# Altium schematic sheet BMS Carrier - Connectors.SchDoc: Connectors
size Tabloid; Author: Liam Sky, Annika Logarta; Revision: 1.0; SheetNumber: 1; SheetTotal: 4; Website: www.uwmidsun.com
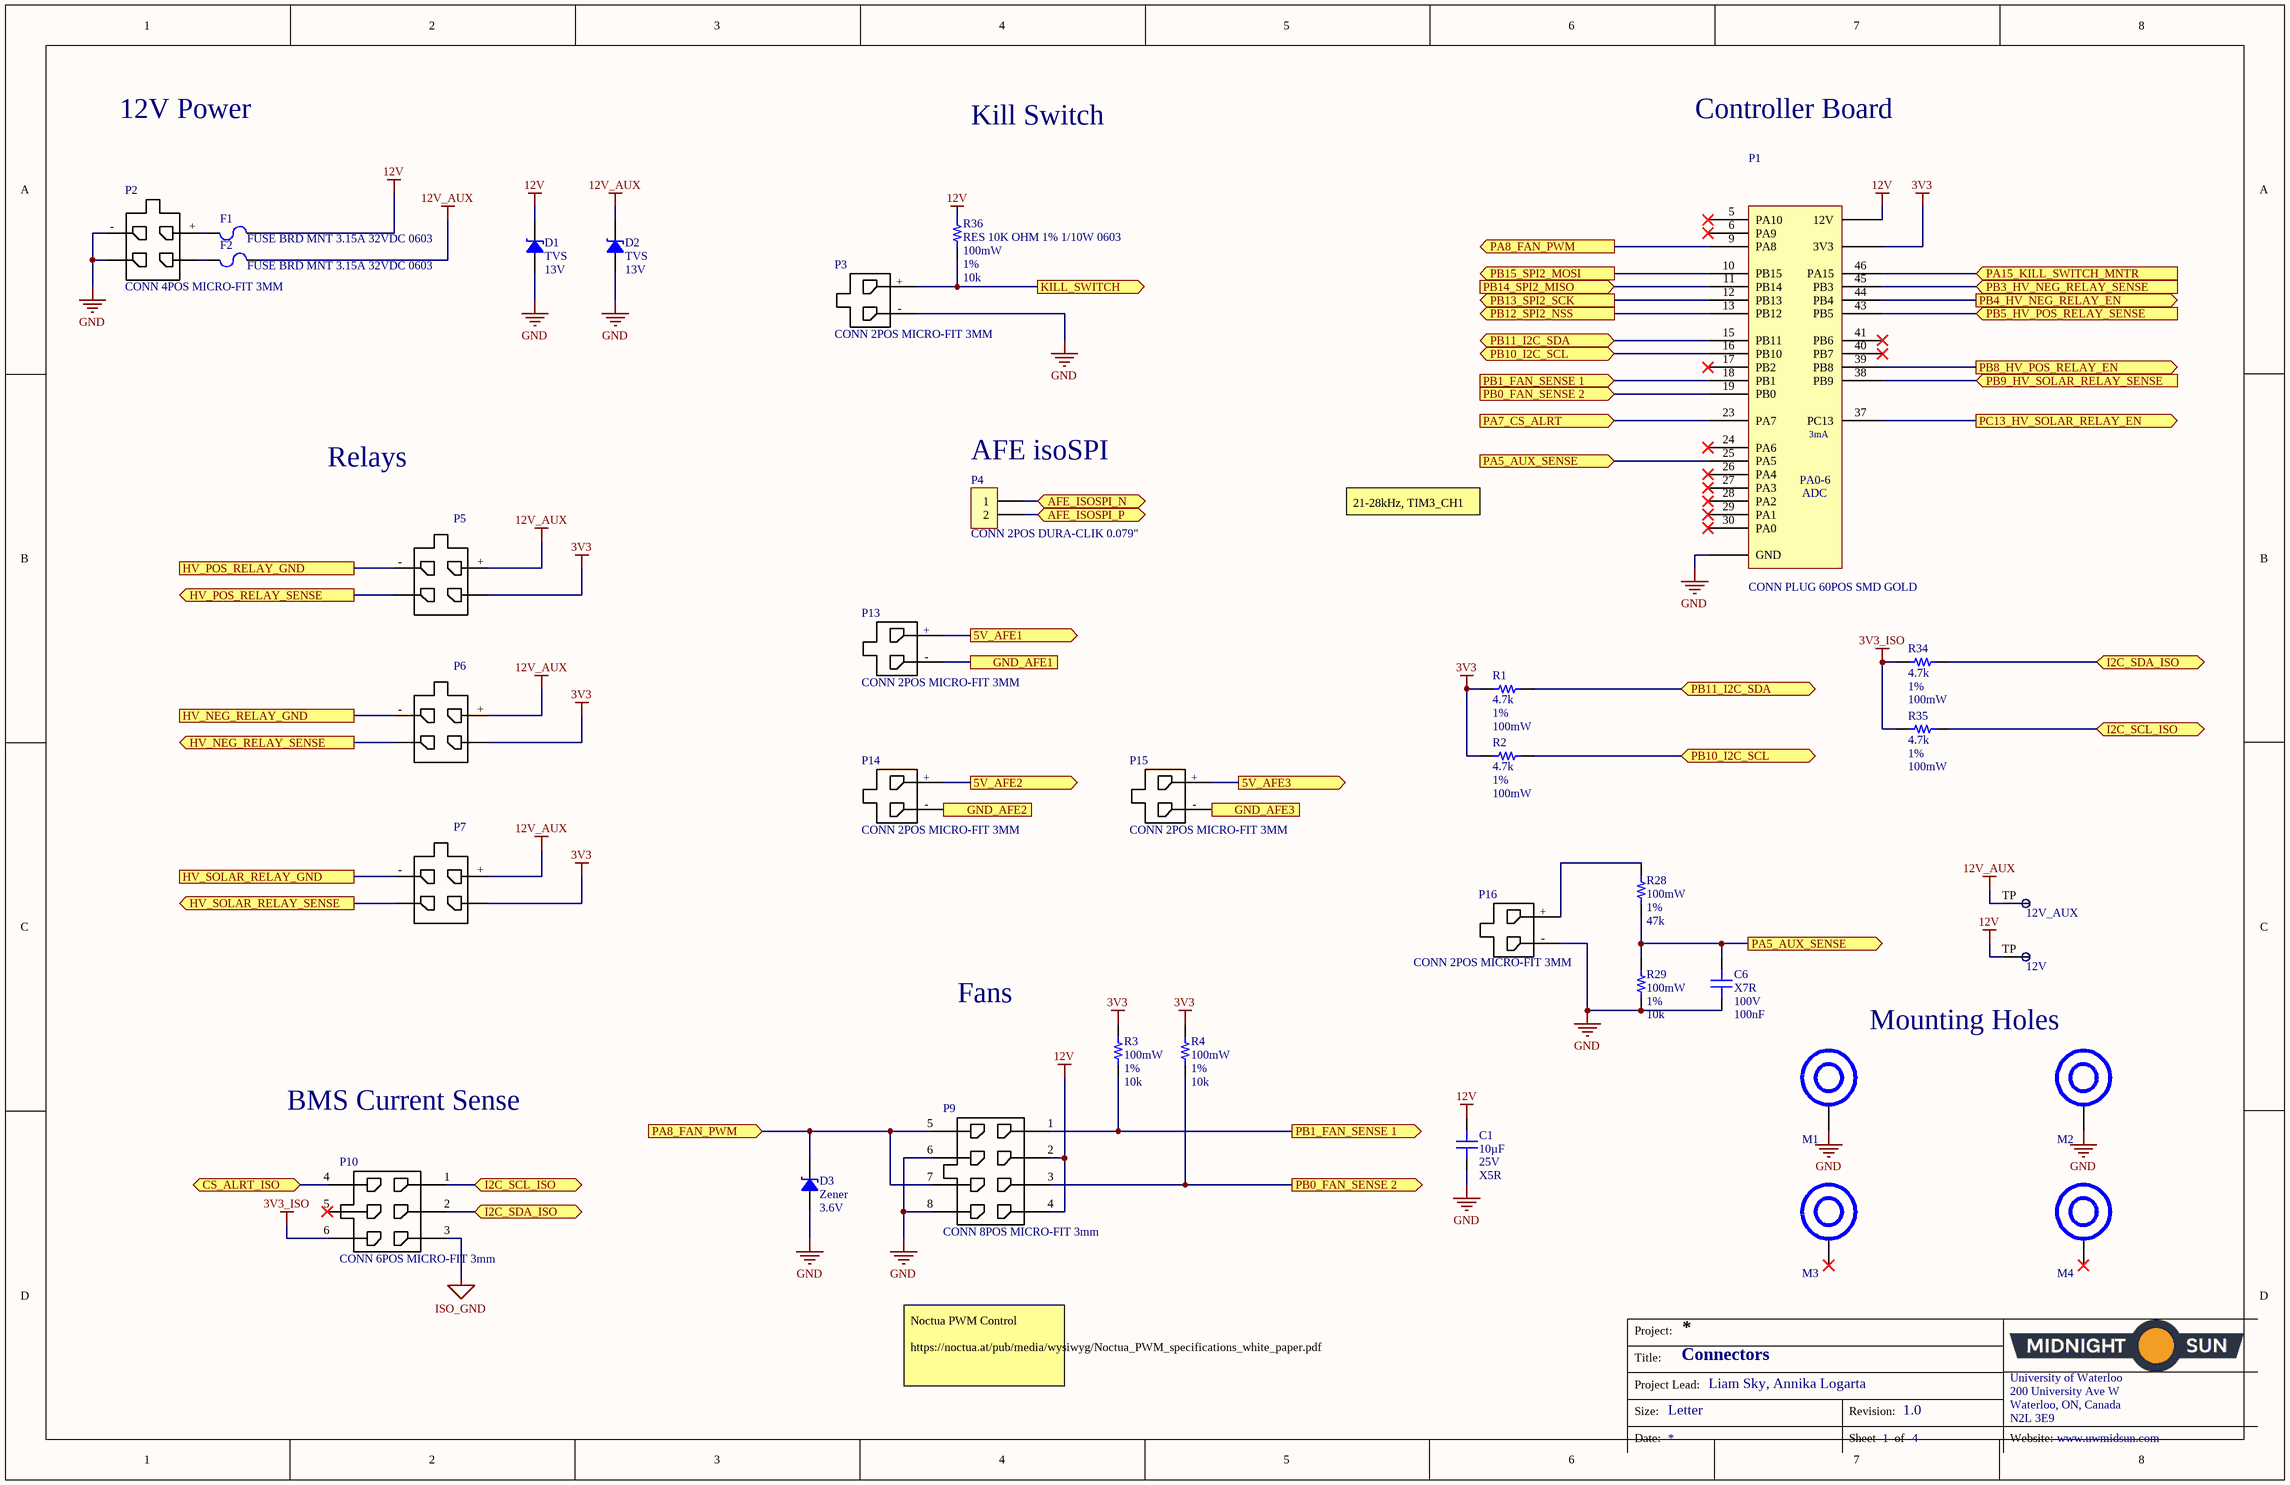
[diagram p0: BMS Carrier - Connectors.SchDoc]

## Parts
12V  Thru Test Point Top  [Thru Test Point Top]  (value not drawn)  (no BOM)
12V_AUX  Thru Test Point Top  [Thru Test Point Top]  (value not drawn)  (no BOM)
C1  Capacitance: 10µF  Voltage Rating: 25V  Dielectric Code: X5R  [CAP 0603_1608]  (hidden comment: CAP CER 10UF 25V 20% X5R 0603)
C6  Dielectric Code: X7R  Voltage Rating: 100V  Capacitance: 100nF  [CAP 0603_1608]  (hidden comment: CAP CER 0.1UF 100V 10% X7R 0603)
D1  Type: TVS  Reverse Blocking Voltage: 13V  [DO 214AC SMA]  (hidden comment: TVS DIODE 13VWM 21.5VC SMB)
D2  Type: TVS  Reverse Blocking Voltage: 13V  [DO 214AC SMA]  (hidden comment: TVS DIODE 13VWM 21.5VC SMB)
D3  Type: Zener  Breakdown Voltage: 3.6V  [SOD 323]  (hidden comment: DIODE ZENER 3.6V 300MW SOD323)
F1  FUSE BRD MNT 3.15A 32VDC 0603  [FER 0603_1608]
F2  FUSE BRD MNT 3.15A 32VDC 0603  [FER 0603_1608]
M1  HEX STANDOFF M2.5X0.45 BRASS 5MM  [HEX STANDOFF M2.5X0.45 BRASS 5MM-Footprint-1]  (value not drawn)
M2  HEX STANDOFF M2.5X0.45 BRASS 5MM  [HEX STANDOFF M2.5X0.45 BRASS 5MM-Footprint-1]  (value not drawn)
M3  HEX STANDOFF M2.5X0.45 BRASS 5MM  [HEX STANDOFF M2.5X0.45 BRASS 5MM-Footprint-1]  (value not drawn)
M4  HEX STANDOFF M2.5X0.45 BRASS 5MM  [HEX STANDOFF M2.5X0.45 BRASS 5MM-Footprint-1]  (value not drawn)
P1  CONN PLUG 60POS SMD GOLD  [CONN PLUG 60POS SMD GOLD-CONTROLLER BOARD]
P2  CONN 4POS MICRO-FIT 3MM  [CONN 4POS MICROFIT (2x2)]
P3  CONN 2POS MICRO-FIT 3MM  [2POS Molex Microfit 3mm Vert]
P4  CONN 2POS DURA-CLIK 0.079"  [CONN, 2POS Dura-Click]
P5  CONN 4POS MICRO-FIT 3MM  [CONN 4POS MICROFIT (2x2)]  (value not drawn)
P6  CONN 4POS MICRO-FIT 3MM  [CONN 4POS MICROFIT (2x2)]  (value not drawn)
P7  CONN 4POS MICRO-FIT 3MM  [CONN 4POS MICROFIT (2x2)]  (value not drawn)
P9  CONN 8POS MICRO-FIT 3mm  [CONN, 8POS MICRO-FIT]
P10  CONN 6POS MICRO-FIT 3mm  [CONN, 6POS MICRO-FIT 3MM]
P13  CONN 2POS MICRO-FIT 3MM  [2POS Molex Microfit 3mm Vert]
P14  CONN 2POS MICRO-FIT 3MM  [2POS Molex Microfit 3mm Vert]
P15  CONN 2POS MICRO-FIT 3MM  [2POS Molex Microfit 3mm Vert]
P16  CONN 2POS MICRO-FIT 3MM  [2POS Molex Microfit 3mm Vert]
R1  Resistance: 4.7k  Tolerance: 1%  Power Rating: 100mW  [RES 0603_1608]  (hidden comment: RES 4.7K OHM 1% 1/10W 0603)
R2  Resistance: 4.7k  Tolerance: 1%  Power Rating: 100mW  [RES 0603_1608]  (hidden comment: RES 4.7K OHM 1% 1/10W 0603)
R3  Power Rating: 100mW  Tolerance: 1%  Resistance: 10k  [RES 0603_1608]  (hidden comment: RES 10K OHM 1% 1/10W 0603)
R4  Power Rating: 100mW  Tolerance: 1%  Resistance: 10k  [RES 0603_1608]  (hidden comment: RES 10K OHM 1% 1/10W 0603)
R28  Power Rating: 100mW  Tolerance: 1%  Resistance: 47k  [RES 0603_1608]  (hidden comment: RES 47K OHM 1% 1/10W 0603)
R29  Power Rating: 100mW  Tolerance: 1%  Resistance: 10k  [RES 0603_1608]  (hidden comment: RES 10K OHM 1% 1/10W 0603)
R34  Resistance: 4.7k  Tolerance: 1%  Power Rating: 100mW  [RES 0603_1608]  (hidden comment: RES 4.7K OHM 1% 1/10W 0603)
R35  Resistance: 4.7k  Tolerance: 1%  Power Rating: 100mW  [RES 0603_1608]  (hidden comment: RES 4.7K OHM 1% 1/10W 0603)
R36  RES 10K OHM 1% 1/10W 0603  Power Rating: 100mW  Tolerance: 1%  Resistance: 10k  [RES 0603_1608]

## Ports
5V_AFE1 (out), 5V_AFE2 (out), 5V_AFE3 (out), AFE_ISOSPI_N (bidir), AFE_ISOSPI_P (bidir), CS_ALRT_ISO (bidir), GND_AFE1, GND_AFE2, GND_AFE3, HV_NEG_RELAY_GND, HV_NEG_RELAY_SENSE (out), HV_POS_RELAY_GND, HV_POS_RELAY_SENSE (out), HV_SOLAR_RELAY_GND, HV_SOLAR_RELAY_SENSE (out), I2C_SCL_ISO (bidir), I2C_SDA_ISO (bidir), KILL_SWITCH (out), PA5_AUX_SENSE (in), PA5_AUX_SENSE (out), PA7_CS_ALRT (in), PA8_FAN_PWM (in), PA8_FAN_PWM (out), PA15_KILL_SWITCH_MNTR (in), PB0_FAN_SENSE 2 (in), PB0_FAN_SENSE 2 (out), PB1_FAN_SENSE 1 (in), PB1_FAN_SENSE 1 (out), PB3_HV_NEG_RELAY_SENSE (in), PB4_HV_NEG_RELAY_EN (out), PB5_HV_POS_RELAY_SENSE (in), PB8_HV_POS_RELAY_EN (out), PB9_HV_SOLAR_RELAY_SENSE (in), PB10_I2C_SCL (bidir), PB11_I2C_SDA (bidir), PB12_SPI2_NSS (out), PB13_SPI2_SCK (out), PB14_SPI2_MISO (in), PB15_SPI2_MOSI (out), PC13_HV_SOLAR_RELAY_EN (out)

## Nets
3V3: P1.53(3V3) P5.1 P6.1 P7.1 R1.2 R2.2 R3.2 R4.2
3V3_ISO: P10.6 R34.2 R35.2
12V: 12V.TP C1.2 D1.1 F1.1 P1.60(12V) P9.2 P9.4 R36.2
12V_AUX: 12V_AUX.TP D2.1 F2.1 P5.3(+) P6.3(+) P7.3(+)
GND: C1.1 C6.2 D1.2 D2.2 D3.2 M1.0 M2.0 P1.31(GND) P2.2 P2.4(-) P3.2(GND) P9.6 P9.8 P16.2(GND) R29.1
ISO_GND: P10.3
5V_AFE1: P13.1(VCC) ; port 5V_AFE1
5V_AFE2: P14.1(VCC) ; port 5V_AFE2
5V_AFE3: P15.1(VCC) ; port 5V_AFE3
AFE_ISOSPI_N: P4.1 ; port AFE_ISOSPI_N
AFE_ISOSPI_P: P4.2 ; port AFE_ISOSPI_P
CS_ALRT_ISO: P10.4 ; port CS_ALRT_ISO
GND_AFE1: P13.2(GND) ; port GND_AFE1
GND_AFE2: P14.2(GND) ; port GND_AFE2
GND_AFE3: P15.2(GND) ; port GND_AFE3
HV_NEG_RELAY_GND: P6.4(-) ; port HV_NEG_RELAY_GND
HV_NEG_RELAY_SENSE: P6.2 ; port HV_NEG_RELAY_SENSE
HV_POS_RELAY_GND: P5.4(-) ; port HV_POS_RELAY_GND
HV_POS_RELAY_SENSE: P5.2 ; port HV_POS_RELAY_SENSE
HV_SOLAR_RELAY_GND: P7.4(-) ; port HV_SOLAR_RELAY_GND
HV_SOLAR_RELAY_SENSE: P7.2 ; port HV_SOLAR_RELAY_SENSE
I2C_SCL_ISO: P10.1 R35.1 ; port I2C_SCL_ISO
I2C_SDA_ISO: P10.2 R34.1 ; port I2C_SDA_ISO
KILL_SWITCH: P3.1(VCC) R36.1 ; port KILL_SWITCH
PA5_AUX_SENSE: C6.1 P1.25(PA5) R28.1 R29.2 ; port PA5_AUX_SENSE
PA7_CS_ALRT: P1.23(PA7) ; port PA7_CS_ALRT
PA8_FAN_PWM: D3.1 P1.9(PA8) P9.5 P9.7 ; port PA8_FAN_PWM
PA15_KILL_SWITCH_MNTR: P1.46(PA15) ; port PA15_KILL_SWITCH_MNTR
PB0_FAN_SENSE 2: P1.19(PB0) P9.3 R4.1 ; port PB0_FAN_SENSE 2
PB1_FAN_SENSE 1: P1.18(PB1) P9.1 R3.1 ; port PB1_FAN_SENSE 1
PB3_HV_NEG_RELAY_SENSE: P1.45(PB3) ; port PB3_HV_NEG_RELAY_SENSE
PB4_HV_NEG_RELAY_EN: P1.44(PB4) ; port PB4_HV_NEG_RELAY_EN
PB5_HV_POS_RELAY_SENSE: P1.43(PB5) ; port PB5_HV_POS_RELAY_SENSE
PB8_HV_POS_RELAY_EN: P1.39(PB8) ; port PB8_HV_POS_RELAY_EN
PB9_HV_SOLAR_RELAY_SENSE: P1.38(PB9) ; port PB9_HV_SOLAR_RELAY_SENSE
PB10_I2C_SCL: P1.16(PB10) R2.1 ; port PB10_I2C_SCL
PB11_I2C_SDA: P1.15(PB11) R1.1 ; port PB11_I2C_SDA
PB12_SPI2_NSS: P1.13(PB12) ; port PB12_SPI2_NSS
PB13_SPI2_SCK: P1.12(PB13) ; port PB13_SPI2_SCK
PB14_SPI2_MISO: P1.11(PB14) ; port PB14_SPI2_MISO
PB15_SPI2_MOSI: P1.10(PB15) ; port PB15_SPI2_MOSI
PC13_HV_SOLAR_RELAY_EN: P1.37(PC13) ; port PC13_HV_SOLAR_RELAY_EN
NetF1_2: F1.2 P2.3(+)
NetF2_2: F2.2 P2.1
NetP16_1: P16.1(VCC) R28.2

Not connected (* = marked no-connect by the designer): M3 0*; M4 0*; P1 5(PA10)* 6(PA9)* 17(PB2)* 24(PA6)* 26(PA4)* 27(PA3)* 28(PA2)* 29(PA1)* 30(PA0)* 40(PB7)* 41(PB6)*; P10 5*

## Notes on the sheet
- 12V Power
- Kill Switch
- Controller Board
- Relays
- (near P4) AFE isoSPI
- 21-28kHz, TIM3_CH1
- Fans
- Mounting Holes
- BMS Current Sense
- Noctua PWM Control
  https://noctua.at/pub/media/wysiwyg/Noctua_PWM_specifications_white_paper.pdf
- Project:
- Title:
- Size:
- Project Lead:
- Letter
- Revision:
- University of Waterloo
- 200 University Ave W
- Waterloo, ON, Canada
- N2L 3E9
- Date:
- Sheet
- of
- Website:
- (in symbol CMP-002-00093-18) 3mA; PA0-6; ADC
- (in symbol CMP-002-00277-7) +; -

## Library data of the parts
12V 12V_AUX = CMP-003-0090-5: Through Hole Test Point Top Layer; Design Item ID: Thru Test Point
C1 = CMP-013-0018-6: 10µF ±20% 25V Ceramic Capacitor X5R 0603 (1608 Metric); Tolerance: 20%; Case/Package: 0603
C6 = CMP-013-0022-14: Ceramic Capacitor, Multilayer, Ceramic, 100V, 10% +Tol, 10% -Tol, X7R, 15% TC, 0.1uF, Surface Mount, 0603; Case/Package: 0603; Tolerance: 10%
D1 D2 = CMP-004-00068-3: Trans Voltage Suppressor Diode, 600W, 13V V(RWM), Bidirectional, 1 Element, Silicon; Breakdown Voltage: 15.15V; Case/Package: DO-214AC
D3 = CMP-004-00067-3: Zener Diode, 3.6V V(Z), 5.56%, 0.3W, Silicon, Unidirectional; Reverse Blocking Voltage: 3.4V; Case/Package: SOD 323
F1 F2 = CMP-005-00024-1: Electric Fuse, Very Fast Blow, 3.15A, 32VDC, 50A (IR), Surface Mount; Voltage Rating (DC): 32V; Resistance (Cold): 29m; Current Rating: 3.15A; Case/Package: 0603
M1-M4 = CMP-00028-00009-8: Hex Standoff Threaded M2.5x0.45 Brass 0.197" (5.00mm)
P1 = CMP-002-00093-18: Height Rec CONNECTOR-10132798-062100LF / 4800 Rohs Compliant: Yes; pin to pad: 31>1+2+3+4+7+8+14+20+21+22+31+32+33+34+35+36+42 53>48+49+50+51+52+53 55>47+54+55+61+62+63+64 60>56+57+58+59+60; Manufacturer 1: Amphenol ICC (FCI); Connector Type: BOARD CONNECTOR; Gender: Male; Pins: 60; Manufacturer Part Number 1: 10132798-062100LF; RoHS Compliant: Yes
P2 P5-P7 = CMP-002-00278-5: Rectangular Power Connector, 4 Contact(s), Male, Solder Terminal, Plug; Connector Type: Power,Rectangular; Contact Resistance: 10mR; Case/Package: Molex Microfit Receptacle; Max Operating Temperature: 105°C; Contact Gender: Male; RoHS Compliant: Yes; Min Operating Temperature: -40°C
P3 P13-P16 = CMP-002-00277-7: Connector Header Through Hole 2 position 0.118" (3.00mm); Connector Type: Power,Rectangular; Max Operating Temperature: 105°C; RoHS Compliant: Yes; Min Operating Temperature: -40°C
P4 = CMP-007-0044-2: 2 Positions Header, Shrouded Connector 0.079" (2.00mm) Surface Mount, Right Angle Tin; Connector Type: Header
P9 = CMP-007-0004-3: Connector Header Through Hole 6 position 0.118" (3.00mm); Connector Type: Header
P10 = CMP-007-0037-4: Connector Header Through Hole 6 position 0.118" (3.00mm)
R1 R2 R34 R35 = CMP-010-0075-8: Fixed Resistor, Metal Glaze/thick Film, 0.1W, 4700ohm, 75V, 1% +/-Tol, 100ppm/Cel, Surface Mount, 0603; Temperature Coefficient: 100ppm/°C; Case/Package: 0603; Voltage Rating: 75V
R3 R4 R29 R36 = CMP-009-00190-14: 10 ±1% 0.1W, 1/10W Chip Resistor 0603 (1608 Metric) Automotive AEC-Q200 Thick Film; Voltage Rating: 75V; Temperature Coefficient: 100ppm/°C; Case/Package: 0603
R28 = CMP-010-0063-10: Fixed Resistor, Metal Glaze/thick Film, 0.1W, 47000ohm, 75V, 1% +/-Tol, 100ppm/Cel, Surface Mount, 0603; Temperature Coefficient: 100ppm/°C; Case/Package: 0603; Voltage Rating: 75V